# Altium schematic sheet ESP32.SchDoc
size A4; SheetNumber: 2; SheetTotal: 2
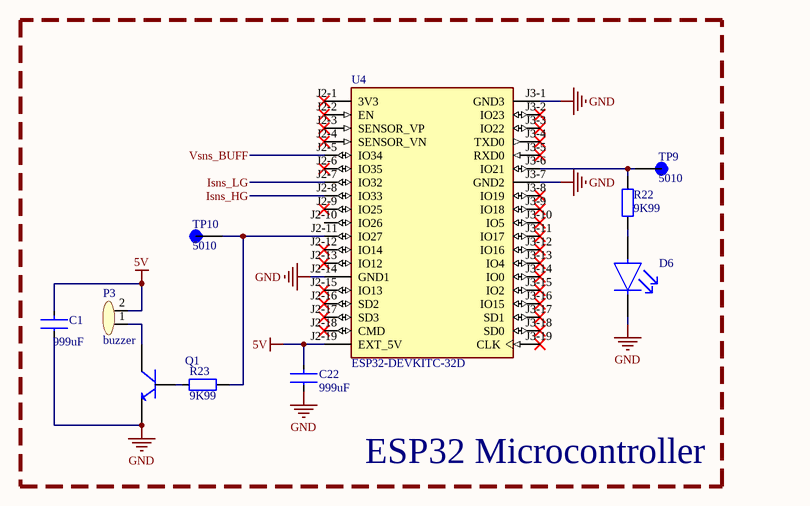
[diagram p0: ESP32.SchDoc]

## Parts
C1  Capacitance: 999uF  [FP-CL21-IPC_A]  (hidden comment: CL21B104KBCNNNC)
C22  Capacitance: 999uF  [FP-CL21-IPC_A]  (hidden comment: CL21B104KBCNNNC)
D6  LTST-C170GKT  [FP-LTST-C170GKT-MFG]  (value not drawn)
P3  buzzer  [ece-buzzer]
Q1  BC547/549  [ece-TO-92Z]  (value not drawn)
R22  Resistance: 9K99  [RESC2013X60X35ML10T20]  (hidden comment: RC0805FR-071KL)
R23  Resistance: 9K99  [RESC2013X60X35ML10T20]  (hidden comment: RC0805FR-071KL)
TP9  5010  [TP_5010]
TP10  5010  [TP_5010]
U4  ESP32-DEVKITC-32D  [MODULE_ESP32-DEVKITC-32D]

## Blocks framed on the sheet
ESP32 Microcontroller: C1 C22 D6 P3 Q1 R22 R23 TP9 TP10 U4

## Nets
5V: C1.1 C22.1 P3.2 U4.J2-19(EXT_5V)
GND: C1.2 C22.2 D6.1(C) Q1.3(E) U4.J2-14(GND1) U4.J3-1(GND3) U4.J3-7(GND2)
Isns_HG: U4.J2-8(IO33)
Isns_LG: U4.J2-7(IO32)
Vsns_BUFF: U4.J2-5(IO34)
NetD6_2: D6.2(A) R22.1
NetP3_1: P3.1 Q1.1(C)
NetQ1_2: Q1.2(B) R23.2
NetR22_2: R22.2 TP9.TP U4.J3-6(IO21)
NetR23_1: R23.1 TP10.TP U4.J2-11(IO27)

Not connected (* = marked no-connect by the designer): U4 J2-1(3V3)* J2-2(EN)* J2-3(SENSOR_VP)* J2-4(SENSOR_VN)* J2-6(IO35)* J2-9(IO25)* J2-10(IO26) J2-12(IO14)* J2-13(IO12)* J2-15(IO13)* J2-16(SD2)* J2-17(SD3)* J2-18(CMD)* J3-2(IO23)* J3-3(IO22)* J3-4(TXD0)* J3-5(RXD0)* J3-8(IO19)* J3-9(IO18)* J3-10(IO5)* J3-11(IO17)* J3-12(IO16)* J3-13(IO4)* J3-14(IO0)* J3-15(IO2)* J3-16(IO15)* J3-17(SD1)* J3-18(SD0)* J3-19(CLK)*

## Library data of the parts
C1 C22 = 0805CAP: 0805 Cap General Purpose; Tolerance: 10%; Material: Ceramic; Voltage Rating (DC): 50V; Dielectric: X7R; Depth: 1.25mm; Height: 0.85mm; Width: 0.049inch; Case Code (Metric): 2012; Case Code (Imperial): 0805; Thickness: 0.037inch; Min Operating Temperature: -55°C; Contact Plating: Tin; Length: 2mm; Mount: Surface Mount; Lead Free: Lead Free; Radiation Hardening: No; Voltage Rating: 50V; Case/Package: 0805; Packaging: Tape and Reel; Max Operating Temperature: 125°C; Voltage: 50V
D6 = CMP-1674-00002-6: LED yellow green 0805 wavelength 569nm light intensity 6mcd Front Mounting; Manufacturer: Lite-On; Lens Style: Diffused; Forward Voltage: 2.1V; Number of Elements: 1; Wavelength: 565nm; Test Current: 10mA; Power Dissipation: 100mW; Reverse Voltage: 5V; Forward Current: 30mA; Lens Transparency: Clear; Viewing Angle: 130°; Lens Color: Colorless; Current: 4A; Shape: Rectangular; Min Operating Temperature: -55°C; Dominant Wavelength: 569nm; Number of Pins: 2; Max Operating Temperature: 85°C; Color: Green; Luminous Intensity: 6mcd; Radiation Hardening: No; Illumination Color: Green; Case Code (Metric): 2012; Case/Package: 0805; Width: 1.25mm; Case Code (Imperial): 0805; Package Quantity: 1; Height: 1.1mm; Depth: 1.25mm; Length: 2mm; Power Rating: 100mW; Lead Free: Lead Free; Number of LEDs: 1; Packaging: Tape and Reel; Mount: Surface Mount; Voltage: 5V; Supplier: Avnet; Supplier Part Number: LTST-C170GKT; Manufacturer Part Number: LTST-C170GKT; RoHS: Compliant; Category: LEDs; Stock: 408000; Pricing: 3000=0.03046, 6000=0.02977, 12000=0.02908, 24000=0.0284, 48000=0.02771 (USD); China RoHS: Compliant; Country of Origin: Mainland China; Export Control Classification Number (ECCN) Code: EAR99; Harmonized Tariff Schedule (HTS) Code: 8541.40.20.00; Introduction Date: 1997-12-01; Lifecycle Status: Production; Mounting Technology: Surface Mount; Number of Circuits: 1; Pins: 2; Number of Terminals: 2; Peak Wavelength: 565nm; REACH SVHC: Yes; Schedule B: 8541402000, 8541402000|8541402000|8541402000|8541402000|8541402000|8541402000|8541402000|8541402000|8541402000|8541402000|8541402000|8541402000|8541402000|8541402000|8541402000|8541402000|8541402000|8541402000|8541402000|8541402000|8541402000|8541402000|8541402000|85; Terminal Pitch: 2.1mm; ComponentLink1URL: https://datasheet.octopart.com:443/LTST-C170GKT-Lite-On-datasheet-180605137.pdf?src-supplier=IHS; ComponentLink1Description: https://datasheet.octopart.com:443/LTST-C170GKT-Lite-On-datasheet-180605137.pdf?src-supplier=IHS; ComponentLink2URL: https://datasheet.octopart.com:443/LTST-C170GKT-Lite-On-datasheet-141439001.pdf?src-supplier=Upverter; ComponentLink2Description: https://datasheet.octopart.com:443/LTST-C170GKT-Lite-On-datasheet-141439001.pdf?src-supplier=Upverter; ComponentLink3URL: https://datasheet.octopart.com:443/LTST-C170GKT-Lite-On-datasheet-159307.pdf?src-supplier=Arrow+Electronics; ComponentLink3Description: https://datasheet.octopart.com:443/LTST-C170GKT-Lite-On-datasheet-159307.pdf?src-supplier=Arrow+Electronics; ComponentLink4URL: https://datasheet.octopart.com:443/LTST-C170GKT-Lite-On-datasheet-8330158.pdf?src-supplier=TME; ComponentLink4Description: https://datasheet.octopart.com:443/LTST-C170GKT-Lite-On-datasheet-8330158.pdf?src-supplier=TME; ComponentLink5URL: https://datasheet.octopart.com:443/LTST-C170GKT-Lite-On-datasheet-26684672.pdf?src-supplier=Future+Electronics; ComponentLink5Description: https://datasheet.octopart.com:443/LTST-C170GKT-Lite-On-datasheet-26684672.pdf?src-supplier=Future+Electronics; ComponentLink6URL: https://datasheet.octopart.com:443/LTST-C170GKT-Lite-On-datasheet-59241.pdf?src-supplier=DigiKey; ComponentLink6Description: https://datasheet.octopart.com:443/LTST-C170GKT-Lite-On-datasheet-59241.pdf?src-supplier=DigiKey; ComponentLink7URL: https://datasheet.octopart.com:443/LTST-C170GKT-Lite-On-datasheet-14174986.pdf?src-supplier=iiiC; ComponentLink7Description: https://datasheet.octopart.com:443/LTST-C170GKT-Lite-On-datasheet-14174986.pdf?src-supplier=iiiC
Q1 = BC547/549: NPN Transistor; Value: BC547/549
R22 R23 = 0805RESISTOR: 0805 General Purpose  0.125W SMD; Manufacturer: Yageo; Temperature Coefficient: 100ppm/degreesC; Voltage Rating (DC): 150V; Max Power Dissipation: 125mW; Tolerance: 1%; Number of Pins: 2; Number of Terminations: 2; Datasheet URL: http://www.yageo.com/NewPortal/yageodocoutput?fileName=/pdf/R-Chip/PYu-RC_Group_51_RoHS_L_5.pdf; Length: 0.079inch; Package Description: 2-Pin Surface Mounted Device, Body 2 x 1.25 mm; Depth: 1.25mm; Height: 0.024inch; Military Standard: Not; Case/Package: 0805; Package Reference: 0805; RoHSCompliant: true; Lead Free: LeadFree; Packaging: TapeandReel; Package Quantity: 1; Datasheet Version: Rev. 5, 10/2016; Min Operating Temperature: -55degC; Voltage Rating: 150V; Composition: ThickFilm; Case Code (Imperial): 0805; Power Rating: 125mW; Width: 0.049inch; Case Code (Metric): 2012; Manufacturer URL: http://www.yageo.com/; Max Operating Temperature: 155degC; REACH SVHC: Unknown; Termination: SMD/SMT
TP9 TP10 = 5010: Test Point MultiPurpose THM .445 L .125 OD Heat Resistant Nylon 46 Red | Keystone Electronics 5010; SnapEDA_Link: https://www.snapeda.com/parts/5010/Keystone/view-part/?ref=snap; Package: NON STANDARD-1 Keystone; Value: *; MF: Keystone Electronics; MP: 5010; Check_prices: https://www.snapeda.com/parts/5010/Keystone/view-part/?ref=eda
U4 = ESP32-DEVKITC-32D: WiFi Development Tools (802.11) ESP32 General Development Kit, ESP32-WROOM-32D on the board; MF: Espressif Systems; SnapEDA_Link: https://www.snapeda.com/parts/ESP32-DEVKITC-32D/Espressif+Systems/view-part/?ref=snap; Package: None; Value: *; MP: ESP32-DEVKITC-32D; Check_prices: https://www.snapeda.com/parts/ESP32-DEVKITC-32D/Espressif+Systems/view-part/?ref=eda